# Altium schematic sheet Power.SchDoc: Power and mechanical
size A3; Organization: Altium Limited; Address1: L3, 12a Rodborough Rd; Address2: Frenchs Forest; Address3: NSW; Address4: Australia 2086; DocumentNumber: 4; Revision: 1.0; SheetNumber: 4; SheetTotal: 8; SheetSize: A3
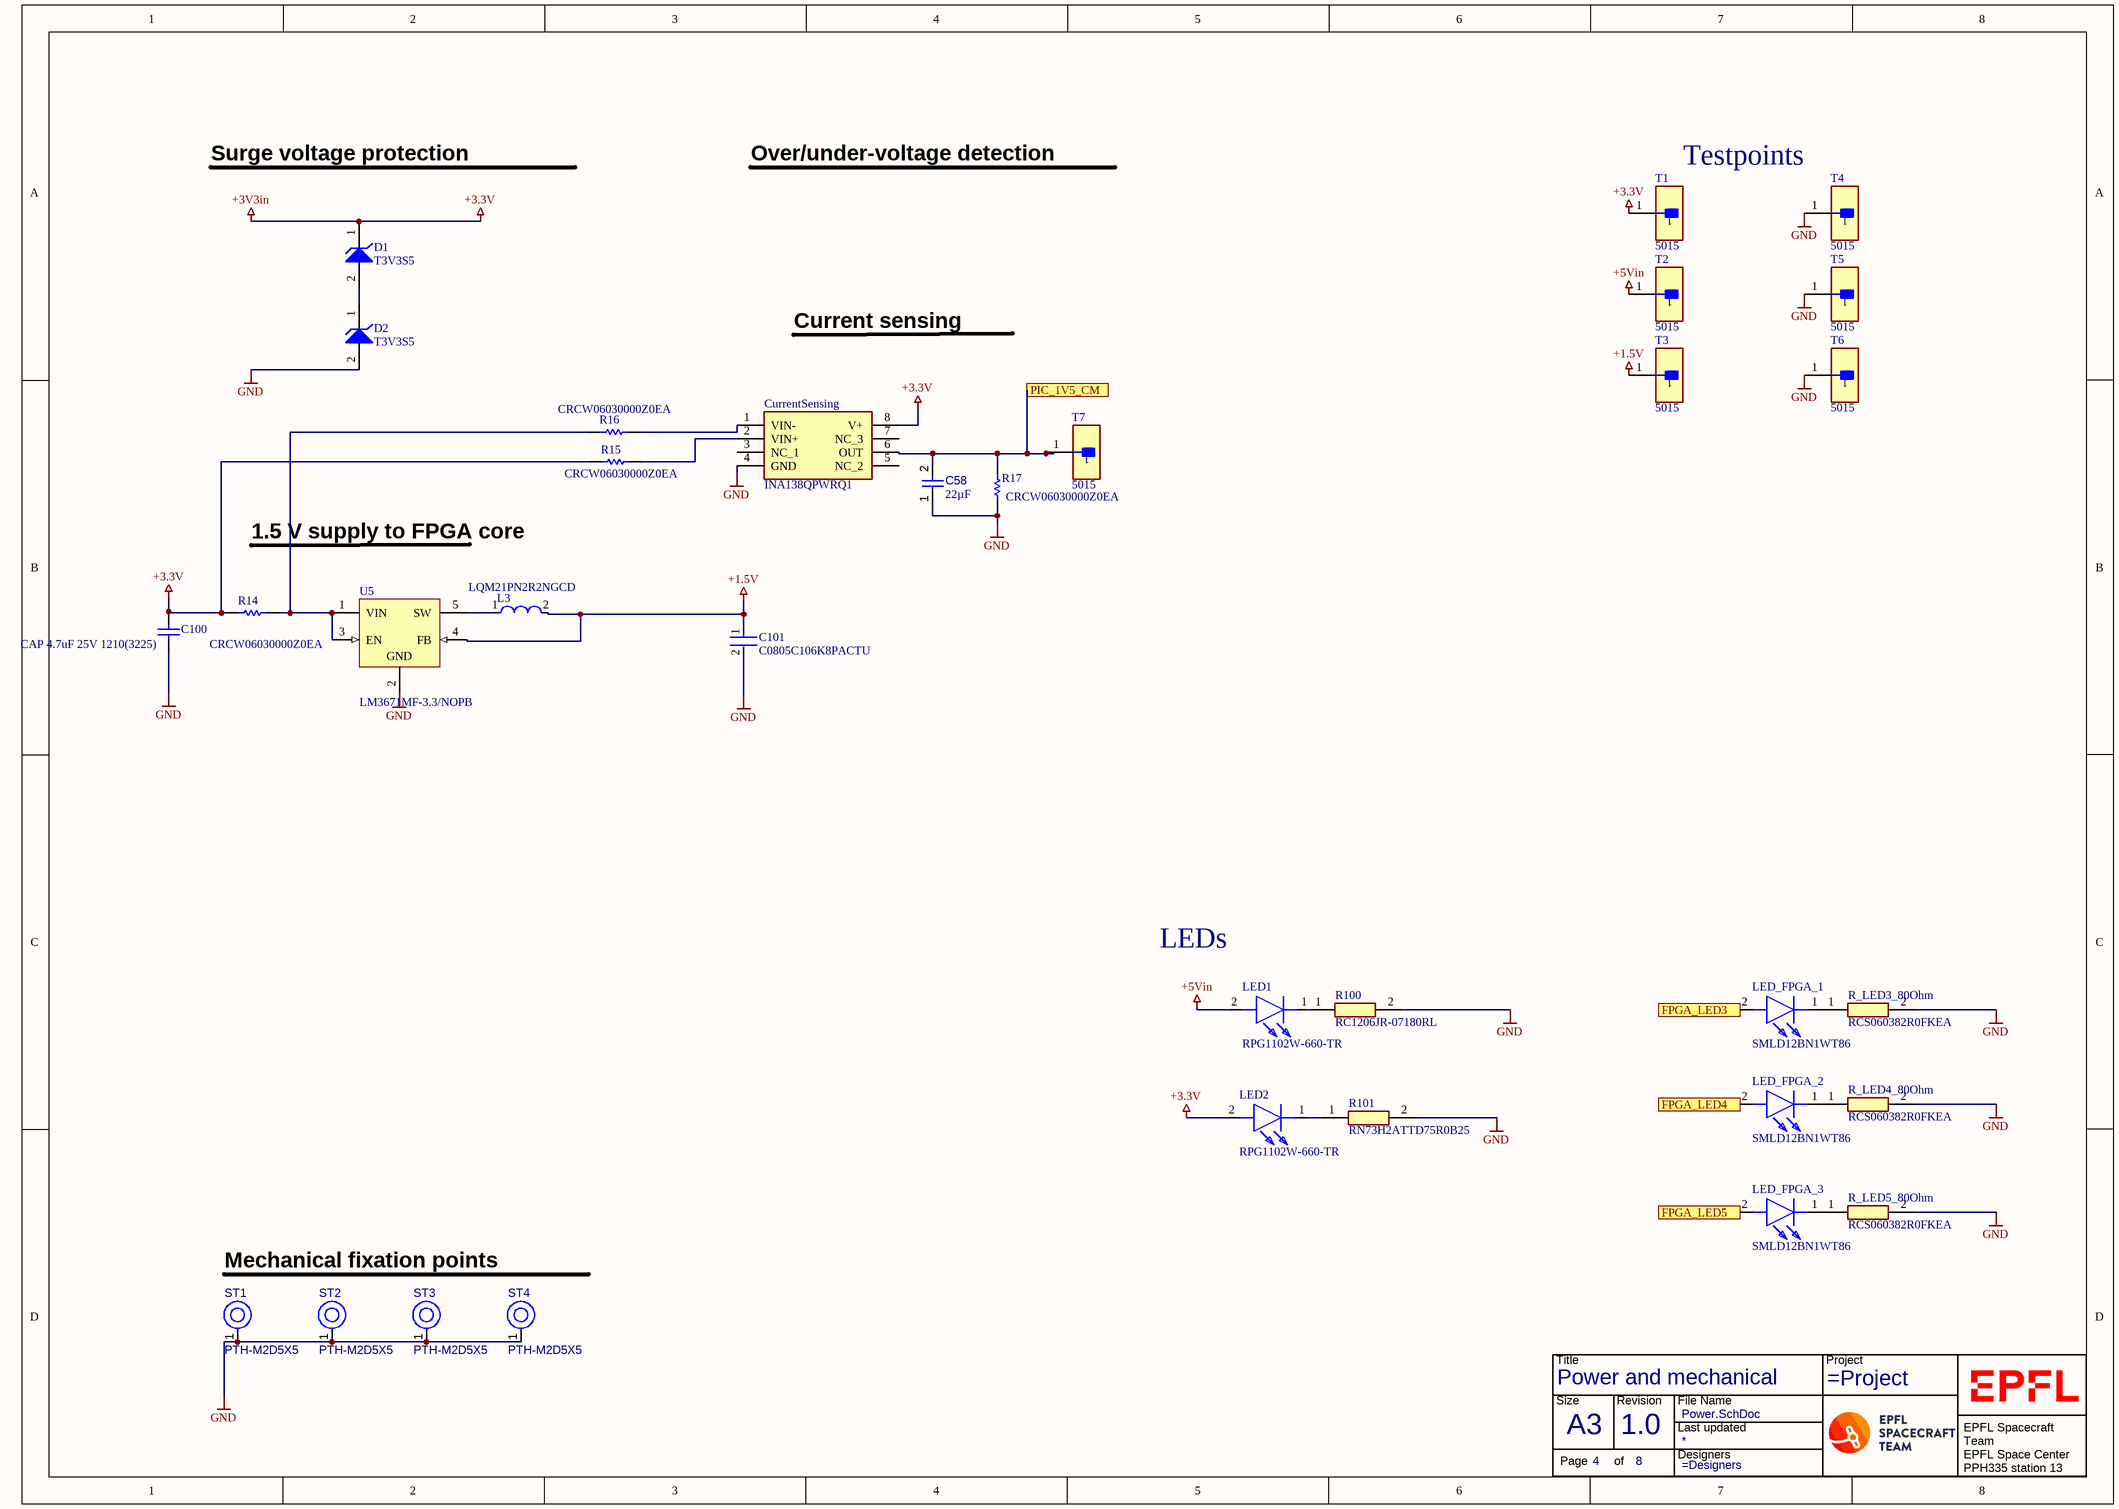
[diagram p0: Power.SchDoc]

## Parts
*  TitleBlock  (value not drawn)  (graphical)
C58  value 22µF  [CAPC0805(2012)145_L]  (hidden comment: Capacitor 22µF +/-40% 16V 0805)
C100  CAP 4.7uF 25V 1210(3225)  [CAPC1210(3225)220_M]
C101  C0805C106K8PACTU  [FP-C0805C-DG-MFG]
CurrentSensing  INA138QPWRQ1  [SOP65P640X120-8N]
D1  T3V3S5  [ONSC-SOD-523-2-502-01_V]
D2  T3V3S5  [ONSC-SOD-523-2-502-01_V]
L3  LQM21PN2R2NGCD  [FP-LQM21PH_G0-IPC_C]
LED1  RPG1102W-660-TR  [LEDC3015X190N]
LED2  RPG1102W-660-TR  [LEDC3015X190N]
LED_FPGA_1  SMLD12BN1WT86  [LEDM168X65N]
LED_FPGA_2  SMLD12BN1WT86  [LEDM168X65N]
LED_FPGA_3  SMLD12BN1WT86  [LEDM168X65N]
R14  CRCW06030000Z0EA  [RESC1609X50X30NL8T20]
R15  CRCW06030000Z0EA  [RESC1609X50X30NL8T20]
R16  CRCW06030000Z0EA  [RESC1609X50X30NL8T20]
R17  CRCW06030000Z0EA  [RESC1609X50X30NL8T20]
R100  RC1206JR-07180RL  [RESC3116X65N]
R101  RN73H2ATTD75R0B25  [RESC2012X60N]
R_LED3_80Ohm  RCS060382R0FKEA  [RESC1608X50N]
R_LED4_80Ohm  RCS060382R0FKEA  [RESC1608X50N]
R_LED5_80Ohm  RCS060382R0FKEA  [RESC1608X50N]
ST1  PTH-M2D5X5  [PTH-M2D5X5]
ST2  PTH-M2D5X5  [PTH-M2D5X5]
ST3  PTH-M2D5X5  [PTH-M2D5X5]
ST4  PTH-M2D5X5  [PTH-M2D5X5]
T1  5015  [FP-5015-MFG]
T2  5015  [FP-5015-MFG]
T3  5015  [FP-5015-MFG]
T4  5015  [FP-5015-MFG]
T5  5015  [FP-5015-MFG]
T6  5015  [FP-5015-MFG]
T7  5015  [FP-5015-MFG]
U5  LM3671MF-3.3/NOPB  [DBV0005A_N]

## Ports
FPGA_LED3, FPGA_LED4, FPGA_LED5, PIC_1V5_CM

## Nets
+1.5V: C101.1 L3.2 T3.1 U5.4(FB)
+3.3V: C100.2 CurrentSensing.8(V+) D1.1(K) LED2.2(A) R14.1 R15.1 T1.1  [also labelled +3V3in]
+5Vin: LED1.2(A) T2.1
GND: C58.1 C100.1 C101.2 CurrentSensing.4(GND) D2.2(A) R17.1 R100.2 R101.2 R_LED3_80Ohm.2 R_LED4_80Ohm.2 R_LED5_80Ohm.2 ST1.1(H1) ST2.1(H1) ST3.1(H1) ST4.1(H1) T4.1 T5.1 T6.1 U5.2(GND)
FPGA_LED3: LED_FPGA_1.2(A) ; port FPGA_LED3
FPGA_LED4: LED_FPGA_2.2(A) ; port FPGA_LED4
FPGA_LED5: LED_FPGA_3.2(A) ; port FPGA_LED5
PIC_1V5_CM: C58.2 CurrentSensing.6(OUT) R17.2 T7.1 ; port PIC_1V5_CM
NetCurrentSensing_1: CurrentSensing.1(VIN-) R16.2
NetCurrentSensing_2: CurrentSensing.2(VIN+) R15.2
NetD1_2: D1.2(A) D2.1(K)
NetL3_1: L3.1 U5.5(SW)
NetLED1_1: LED1.1(K) R100.1
NetLED2_1: LED2.1(K) R101.1
NetLED_FPGA_1_1: LED_FPGA_1.1(K) R_LED3_80Ohm.1
NetLED_FPGA_2_1: LED_FPGA_2.1(K) R_LED4_80Ohm.1
NetLED_FPGA_3_1: LED_FPGA_3.1(K) R_LED5_80Ohm.1
NetR14_2: R14.2 R16.1 U5.1(VIN) U5.3(EN)

Not connected (* = marked no-connect by the designer): CurrentSensing 3(NC_1) 5(NC_2) 7(NC_3)

## Notes on the sheet
- Surge voltage protection
- Over/under-voltage detection
- Testpoints
- Current sensing
- 1.5 V supply to FPGA core
- LEDs
- Mechanical fixation points
- Title
- Size:
- Date:
- A3
- Number:
- Time:
- Revision:
- Sheet
- of
- File:
- (in symbol TitleBlock) Title; Project; Size; Revision; File Name; Last updated; Designers; Page; of; EPFL Spacecraft Team / EPFL Space Center / PPH335 station 13 / CH-1015 Lausanne

## Library data of the parts
* = TitleBlock: Title Block with generall information
C58 = CMP-001-00081-2: Chip Capacitor, 22µF +/-40%, 16V, 0805, Thickness 1.45 mm; Tolerance: 5%; Min Operating Temperature: -55°C; Mounting Technology: SMT; Case/Package: 0402; Pins: 2; Voltage Rating: 16V; Max Operating Temperature: 85°C
C100 = CMP-1038-02151-2: CAP 4.7uF 25V ±10% 1210 (3225 Metric) Thickness 2.2mm SMD; Case-Metric: 3225; Case-EIA: 1210; Tolerance: Â±10%; Value: 4.7uF; Technology: SMT; Max Thickness: 2.2 mm; Rated Voltage: 25 V
C101 = CMP-2007-03243-2: CAP CER 10UF 10V X5R 0805; Manufacturer: Kemet; 3DS Part Number: 220-00001; Tolerance: 10%; Temperature Coefficient: 15%; Material: Ceramic; Device Class L2: Capacitors; Device Class L1: Passive Components; ComponentLink2URL: https://content.kemet.com/datasheets/KEM_C1006_X5R_SMD.pdf; Height: 1.4mm; Lead Free: Yes; Manufacturer Part Number: C0805C106K8PACTU; Digikey Description: CAP CER 10UF 10V X5R 0805; Octopart: https://octopart.com/c0805c106k8pactu-kemet-98697; Capacitance: 10uF; Value: 10uF; Temperature Range Low: -55°C; Temperature: -55°C to +85°C; Automotive: No; Mouser Description: CAP CER 10UF 10V X5R 0805; Ipc Land Pattern Name: CAPC200125X125; Temperature Range High: +85°C; Voltage: 10V; RoHS: TRUE; Device Class L3: Ceramic Capacitors; ComponentLink2Description: Datasheet; Voltage Rating: 10V; Package: C0805C-DG; Temperature Characteristic: X5R; Category: Cap
CurrentSensing = INA138QPWRQ1: Integrated Circuit; Manufacturer_Name: Texas Instruments; Datasheet Link: http://www.ti.com/lit/gpn/ina138-q1; Height: 1.2mm; Mouser2 Part Number: 595-INA138QPWRQ1; Mouser2 Price/Stock: https://www.mouser.com/Search/Refine.aspx?Keyword=595-INA138QPWRQ1; Manufacturer_Part_Number: INA138QPWRQ1
D1 D2 = CMP-1063-00100-1: Transient Voltage Suppressor, Micro-Packaged Diode for ESD Protection, 2-Pin SOD-523, Pb-Free, Tape and Reel; Manufacturer: On Semiconductor; PartNumber: ESD5Z7.0T1G; VRWM Max (V): 7; IR Max (uA): 0.01; Direction: Unidirectional; PPK Max (W): 200; Number of Lines: 1; V(BR) Min (V): 7.5; PackageVersion: Rev. E, 09/2010; PackageReference: SOD-523-2-502-01; ComponentLink3Description: Package Specification; ComponentLink3URL: http://www.onsemi.com/pub_link/Collateral/502-01.PDF; PackageDescription: 2-Pin SOD, Body 1.2 x 0.8 mm; Packing: Tape and Reel; RoHS: Pb-Free; Mounting Technology: Surface Mount; DatasheetVersion: Rev. 10; ComponentLink2URL: http://www.onsemi.cn/pub_link/Collateral/ESD5Z2.5T1-D.PDF; ComponentLink1Description: Manufacturer URL; ComponentLink1URL: http://www.onsemi.com/; ComponentLink2Description: Datasheet
L3 = CMP-06042-016317-1: Multilayer Type Inductor for Power Lines, 0805 (2012), 2.2μH, 30%, 0.288Ω, 0.8A; Test Frequency: 1MHz; Shielding: Shielded; Current Rating: 800mA; Self Resonant Frequency: 40MHz; Core Material: Ferrite; Inductance: 2.2uH; DC Resistance (DCR): 288mR; RoHS Compliant: Yes; REACH SVHC: No SVHC; Inductance Tolerance: 30%; Package Quantity: 4000; Military Standard: Not; Max Operating Temperature: 125°C; Radiation Hardening: No; Series: LQM; Height - Seated (Max): 0.039inch; Tolerance: 30%; Height: 0.9mm; Lead Free: Lead Free; Case Code (Metric): 2012; Packaging: Tape and Reel; Termination: SMD/SMT; Case Code (Imperial): 0805; Min Operating Temperature: -55°C; Depth: 1.4mm; Mount: Surface Mount; Length: 2mm; DC Current: 800mA; Case/Package: 0805; Max DC Current: 800mA; Width: 0.049inch
LED1 LED2 = RPG1102W-660-TR: LED; Manufacturer_Name: Stanley Electric; Height: 1.9mm; Mouser2 Part Number: 327-RPG1102W660TR; Mouser2 Price/Stock: https://www.mouser.com/Search/Refine.aspx?Keyword=327-RPG1102W660TR; Manufacturer_Part_Number: RPG1102W-660-TR
LED_FPGA_1-LED_FPGA_3 = SMLD12BN1WT86: LED; Manufacturer_Name: ROHM Semiconductor; Datasheet Link: https://www.rohm.com/datasheet/SMLD12BN1W/smld12-e; Height: 0.65mm; Manufacturer_Part_Number: SMLD12BN1WT86
R14-R17 = CMP-2000-03816-5: Chip Resistor, 0 Ohm, Jumper, 100 mW, -55 to 155 degC, 0603 (1608 Metric), RoHS, Tape and Reel; Manufacturer: Vishay Semiconductor; Voltage Rating: 75 V; Package Quantity: 5000; DatasheetVersion: 06/2012; Min Operating Temperature: -55 degC; ComponentLink1URL: http://www.vishay.com/; Mounting Technology: Surface Mount; Height: 0.45 mm; ComponentLink1Description: Manufacturer URL; REACH SVHC: Unknown; PackageReference: 0603; Packaging: Tape and Reel; Max Operating Temperature: 155 degC; Mount: Surface Mount; ComponentLink2Description: Datasheet; PackageDescription: 2-Pin Surface Mount Device, Body 1.575 x 0.85 mm; Length: 1.55 mm; ComponentLink2URL: http://www.vishay.com/docs/20035/dcrcwe3.pdf; Pins: 2; RoHSCompliant: true
R100 = RC1206JR-07180RL: Resistor; Manufacturer_Name: YAGEO (PHYCOMP); Datasheet Link: https://www.sos.sk/productdata/35/10/4/35104/RC1206.pdf; Height: 0.65mm; Manufacturer_Part_Number: RC1206JR-07180RL
R101 = RN73H2ATTD75R0B25: Resistor; Manufacturer_Name: KOA Speer; Datasheet Link: https://www.mouser.de/datasheet/2/219/RN73H-1843478.pdf; Height: 0.6mm; Manufacturer_Part_Number: RN73H2ATTD75R0B25
R_LED3_80Ohm R_LED4_80Ohm R_LED5_80Ohm = RCS060382R0FKEA: Resistor; Manufacturer_Name: Vishay; Datasheet Link: https://componentsearchengine.com//RCS060382R0FKEA.pdf; Height: 0.5mm; Mouser2 Part Number: 71-RCS060382R0FKEA; Mouser2 Price/Stock: https://www.mouser.com/Search/Refine.aspx?Keyword=71-RCS060382R0FKEA; Manufacturer_Part_Number: RCS060382R0FKEA
ST1-ST4 = CMP-00028-00004-1: M2 PTH (2.5mm), 5mm pad; Pins: 1
T1-T7 = CMP-2000-05183-2: PC TEST POINT MINIATURE; Manufacturer: keystone; Number Of Contacts: 1; Conn Orientation: Straight; Category: Conn; Manufacturer Part Number: 5015; Digikey Description: PC TEST POINT MINIATURE; Automotive: No; Lead Free: Yes; Octopart: https://octopart.com/5015-keystone-3822; ComponentLink2URL: http://www.keyelco.com/product-pdf.cfm?p=1353; Package: 5015; RoHS: TRUE; Device Class L3: unset; Device Class L2: unset; Contact Material: Silver; Device Class L1: Connectors; Height: 1.65mm; ComponentLink2Description: Datasheet
U5 = CMP-0063-01132-3: 2MHz, 600mA Step-Down DC-DC Converter, 5-pin SOT-23, Pb-Free; Manufacturer: Texas Instruments; CompType: MiscPower; PowerWise: Y; PackageTopMarking: SJEB*XTT; PackageDescription: Molded SOT-23, .115 x .063 x .040 in Body, 5 Lead, .0375 in Pitch; ComponentLink1Description: Datasheet URL; PackageReference: DBV0005A; PinCount: 5; RoHS: Y; ComponentLink1URL: http://www.ti.com/general/docs/lit/getliterature.tsp?genericPartNumber=LM3671&fileType=pdf